# Altium project isg_cena_host_board_rev1.PrjPcb (part 2 of 2)

## Sheet DACs.SchDoc
size A; SheetNumber: 7; SheetTotal: 9
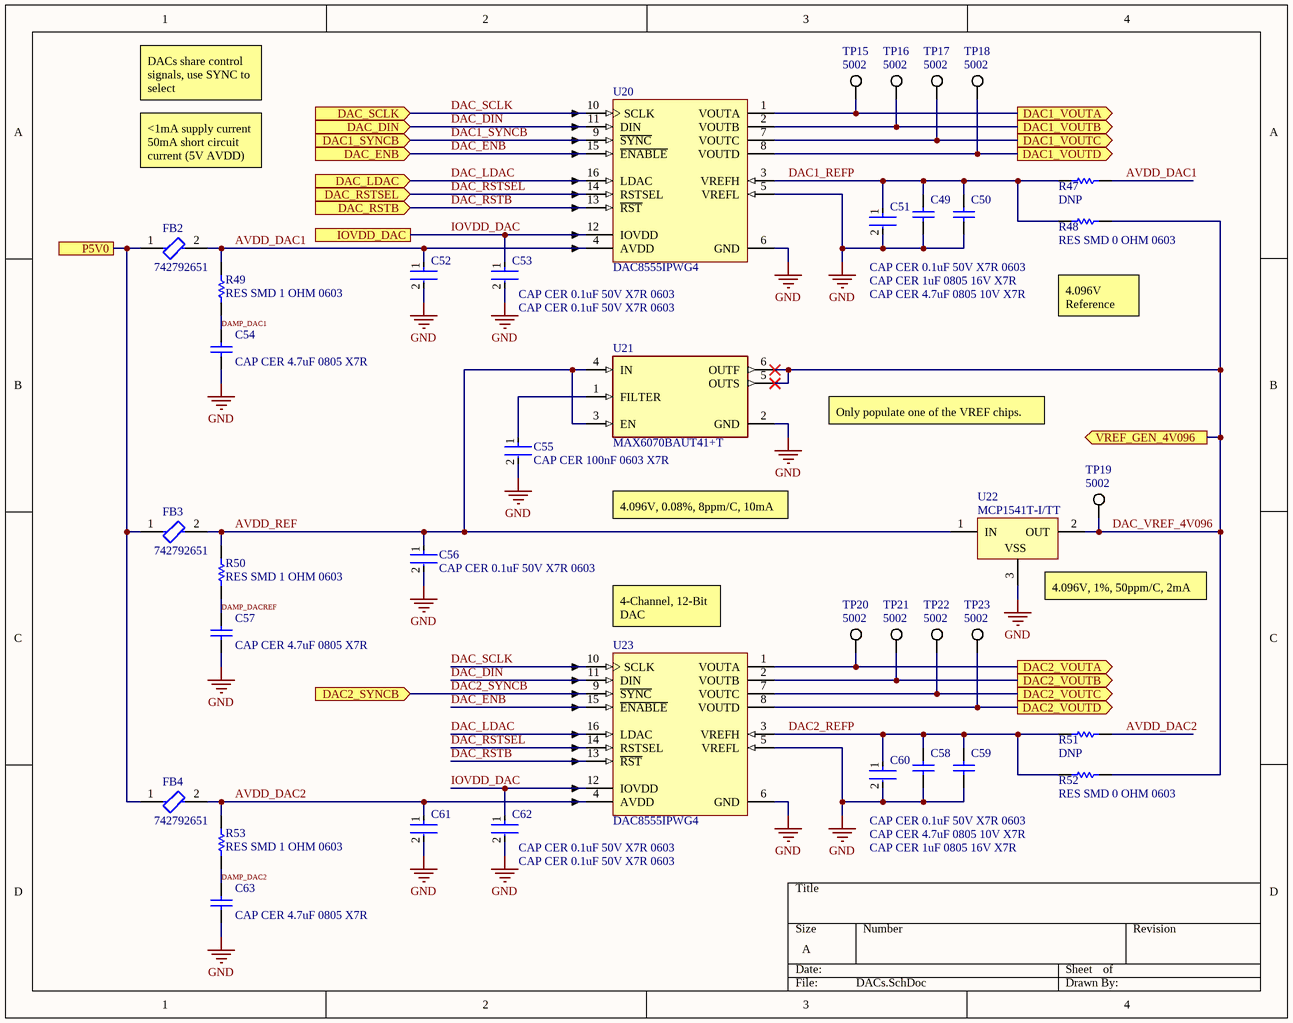
[diagram p5: DACs.SchDoc]

### Parts
(Parts that share a designator on the sheet are numbered #1, #2 ... from top to bottom, then left to right.)
C49  CAP CER 1uF 0805 16V X7R  [CAPC2013X140X50NL20T25]
C50  CAP CER 4.7uF 0805 10V X7R  [CAPC2013X140X50NL20T25]
C51  CAP CER 0.1uF 50V X7R 0603  [FP-CC0603-DA-MFG]
C52  CAP CER 0.1uF 50V X7R 0603  [FP-CC0603-DA-MFG]
C53  CAP CER 0.1uF 50V X7R 0603  [FP-CC0603-DA-MFG]
C54  CAP CER 4.7uF 0805 X7R  [CAPC2013X140X50NL20T25]
C55  CAP CER 100nF 0603 X7R  [FP-CC0603-DA-MFG]
C56  CAP CER 0.1uF 50V X7R 0603  [FP-CC0603-DA-MFG]
C57  CAP CER 4.7uF 0805 X7R  [CAPC2013X140X50NL20T25]
C58#1  CAP CER 1uF 0805 16V X7R  [CAPC2013X140X50NL20T25]
C59#1  CAP CER 4.7uF 0805 10V X7R  [CAPC2013X140X50NL20T25]
C60#1  CAP CER 0.1uF 50V X7R 0603  [FP-CC0603-DA-MFG]
C61#1  CAP CER 0.1uF 50V X7R 0603  [FP-CC0603-DA-MFG]
C62#1  CAP CER 0.1uF 50V X7R 0603  [FP-CC0603-DA-MFG]
C63#1  CAP CER 4.7uF 0805 X7R  [CAPC2013X140X50NL20T25]
FB2  742792651  [FP-742792651-MFG]
FB3  742792651  [FP-742792651-MFG]
FB4  742792651  [FP-742792651-MFG]
R47  DNP  [RESC1609X50X30LL10T20]
R48  RES SMD 0 OHM 0603  [RESC1609X50X30LL10T20]
R49  RES SMD 1 OHM 0603  [RESC1609X50X30LL10T20]
R50#1  RES SMD 1 OHM 0603  [RESC1609X50X30LL10T20]
R51#1  DNP  [RESC1609X50X30LL10T20]
R52#1  RES SMD 0 OHM 0603  [RESC1609X50X30LL10T20]
R53#1  RES SMD 1 OHM 0603  [RESC1609X50X30LL10T20]
TP15  5002  [KSTN-5002]
TP16  5002  [KSTN-5002]
TP17  5002  [KSTN-5002]
TP18  5002  [KSTN-5002]
TP19  5002  [KSTN-5002]
TP20  5002  [KSTN-5002]
TP21  5002  [KSTN-5002]
TP22  5002  [KSTN-5002]
TP23#2  5002  [KSTN-5002]
U20  DAC8555IPWG4  [TI-PW16_L]
U21  MAX6070BAUT41+T  [FP-U6-5-MFG]
U22  MCP1541T-I/TT  [SOT-23-TT3_L]
U23  DAC8555IPWG4  [TI-PW16_L]

### Ports
DAC1_SYNCB (in), DAC1_VOUTA (out), DAC1_VOUTB (out), DAC1_VOUTC (out), DAC1_VOUTD (out), DAC2_SYNCB (in), DAC2_VOUTA (out), DAC2_VOUTB (out), DAC2_VOUTC (out), DAC2_VOUTD (out), DAC_DIN (in), DAC_ENB (in), DAC_LDAC (in), DAC_RSTB (in), DAC_RSTSEL (in), DAC_SCLK (in), IOVDD_DAC, P5V0, VREF_GEN_4V096 (out)

### Nets
GND: C49.2 C50.2 C51.2 C52.2 C53.2 C54.2 C55.2 C56.2 C57.2 C58#1.2 C59#1.2 C60#1.2 C61#1.2 C62#1.2 C63#1.2 U20.5(VREFL) U20.6(GND) U21.2(GND) U22.3(VSS) U23.5(VREFL) U23.6(GND)
IOVDD_DAC: C53.1 C62#1.1 U20.12(IOVDD) U23.12(IOVDD) ; port IOVDD_DAC  [project net IOVDD]
P5V0: FB2.1 FB3.1 FB4.1 ; port P5V0
AVDD_DAC1: C52.1 FB2.2 R47.2 R49.2 U20.4(AVDD)
AVDD_DAC2: C61#1.1 FB4.2 R51#1.2 R53#1.2 U23.4(AVDD)
AVDD_REF: C56.1 FB3.2 R50#1.2 U21.3(EN) U21.4(IN) U22.1(IN)
DAC1_REFP: C49.1 C50.1 C51.1 R47.1 R48.1 U20.3(VREFH)
DAC1_SYNCB: U20.9(~{SYNC}) ; port DAC1_SYNCB
DAC1_VOUTA: TP15.1 U20.1(VOUTA) ; port DAC1_VOUTA
DAC1_VOUTB: TP16.1 U20.2(VOUTB) ; port DAC1_VOUTB
DAC1_VOUTC: TP17.1 U20.7(VOUTC) ; port DAC1_VOUTC
DAC1_VOUTD: TP18.1 U20.8(VOUTD) ; port DAC1_VOUTD
DAC2_REFP: C58#1.1 C59#1.1 C60#1.1 R51#1.1 R52#1.1 U23.3(VREFH)
DAC2_SYNCB: U23.9(~{SYNC}) ; port DAC2_SYNCB
DAC2_VOUTA: TP20.1 U23.1(VOUTA) ; port DAC2_VOUTA
DAC2_VOUTB: TP21.1 U23.2(VOUTB) ; port DAC2_VOUTB
DAC2_VOUTC: TP22.1 U23.7(VOUTC) ; port DAC2_VOUTC
DAC2_VOUTD: TP23#2.1 U23.8(VOUTD) ; port DAC2_VOUTD
DAC_DIN: U20.11(DIN) U23.11(DIN) ; port DAC_DIN
DAC_ENB: U20.15(~{ENABLE}) U23.15(~{ENABLE}) ; port DAC_ENB
DAC_LDAC: U20.16(LDAC) U23.16(LDAC) ; port DAC_LDAC
DAC_RSTB: U20.13(~{RST}) U23.13(~{RST}) ; port DAC_RSTB
DAC_RSTSEL: U20.14(RSTSEL) U23.14(RSTSEL) ; port DAC_RSTSEL
DAC_SCLK: U20.10(SCLK) U23.10(SCLK) ; port DAC_SCLK
DAC_VREF_4V096: R48.2 R52#1.2 TP19.1 U21.5(OUTS) U21.6(OUTF) U22.2(OUT) ; port VREF_GEN_4V096
DAMP_DAC1: C54.1 R49.1
DAMP_DAC2: C63#1.1 R53#1.1
DAMP_DACREF: C57.1 R50#1.1
NetC55_1: C55.1 U21.1(FILTER)

### Notes on the sheet
- DACs share control signals, use SYNC to select
- <1mA supply current
  50mA short circuit current (5V AVDD)
- 4.096V Reference
- Only populate one of the VREF chips.
- 4.096V, 0.08%, 8ppm/C, 10mA
- (near U23) 4-Channel, 12-Bit DAC
- (near U22) 4.096V, 1%, 50ppm/C, 2mA

### Library data of the parts
C49 C50 C54 C57 C58#1 C59#1 C63#1 = CMP-2007-04677-1: Part Number: 0805ZC475KAT2A; Manufacturer: AVX Interconnect / Elco
C51-C53 C56 C60#1 C61#1 C62#1 = CMP-03422-000030-1: Manufacturer Part Number: CC0603KRX7R7BB104; Manufacturer: YAGEO; Voltage Rating: 16 V; Tolerance: 0.1; Value: 100 nF; Temperature Coefficient: 15%; Material: Ceramic; Package: CC0603-DA; ComponentLink2Description: Datasheet; Octopart: https://octopart.com/cc0603krx7r7bb104-yageo-192941; Temperature Range High: +125°C; Digikey Description: CAP CER 0.1UF 16V X7R 0603; Voltage: 16 V; Device Class L2: Capacitors; Height: 0.9mm; Temperature: -55°C to +125°C; Device Class L1: Passive Components; Device Class L3: Ceramic Capacitors; ComponentLink2URL: http://www.yageo.com/documents/recent/UPY-GPHC_X7R_6.3V-to-50V_18.pdf; Footprint Url: http://www.yageo.com/exep/pages/download/literatures/UPY-C_GEN_24.pdf; RoHS: TRUE; Temperature Range Low: -55°C; Temperature Characteristic: X7R; Lead Free: Yes; Capacitance: 100 nF; Category: Cap; Mouser Description: Multilayer Ceramic Capacitor, CC Series, 0.1 - F, - 10%, X7R, 16 V, 0603 [1608 Metric]; Automotive: No
C55 = CMP-03422-000030-1: CAP CER 0.1UF 16V X7R 0603; Manufacturer Part Number: CC0603KRX7R7BB104; Manufacturer: YAGEO; Tolerance: 0.1; Temperature Coefficient: 15%; Material: Ceramic; Voltage Rating: 16 V; Package: CC0603-DA; ComponentLink2Description: Datasheet; Octopart: https://octopart.com/cc0603krx7r7bb104-yageo-192941; Temperature Range High: +125°C; Digikey Description: CAP CER 0.1UF 16V X7R 0603; Value: 100 nF; Voltage: 16 V; Device Class L2: Capacitors; Height: 0.9mm; Temperature: -55°C to +125°C; Device Class L1: Passive Components; Device Class L3: Ceramic Capacitors; ComponentLink2URL: http://www.yageo.com/documents/recent/UPY-GPHC_X7R_6.3V-to-50V_18.pdf; Footprint Url: http://www.yageo.com/exep/pages/download/literatures/UPY-C_GEN_24.pdf; RoHS: TRUE; Temperature Range Low: -55°C; Temperature Characteristic: X7R; Lead Free: Yes; Capacitance: 100 nF; Category: Cap; Mouser Description: Multilayer Ceramic Capacitor, CC Series, 0.1 - F, - 10%, X7R, 16 V, 0603 [1608 Metric]; Automotive: No
FB2-FB4 = CMP-0220-00181-2: FERRITE BEAD 600 OHM 0603 1LN; Tolerance: 25%; DC Resistance (DCR): 200mR; Inductance: 0.36H; Current Rating: 1A; Test Frequency: 100MHz; Impedance: 600R; Number of Lines: 1; Length: 1.6mm; Termination: SMD/SMT; Case Code (Metric): 1608; Case/Package: SMD/SMT; Min Operating Temperature: -55°C; Resistance: 200mR; Height: 0.8mm; Width: 0.8mm; Max Operating Temperature: 125°C; Package Quantity: 1; Mount: Surface Mount; Max DC Current: 1A; Max Current Rating: 1A; Weight: 0.000141oz; Packaging: Tape and Reel; Lead Free: Lead Free; Case Code (Imperial): 0603; Series: WE-CBF; Core Material: Ferrite; Material: Ferrite; RoHS Compliant: Yes; Depth: 0.8mm
R47-R49 R50#1 R51#1 R52#1 R53#1 = CMP-2000-03820-1: Part Number: CRCW0603100KFKEA; Manufacturer: Vishay Dale
TP15-TP22 TP23#2 = CMP-2000-05182-1: Test Point, White, 1-Pin THD, RoHS, Bulk; Manufacturer: KeystoneElectronics; Outside Diameter: 2.54mm; Plating: Silver; Mounting Hole Size: 1mm; Product: TestPoints; Packaging: Bulk; Manufacturer URL: http://www.keyelco.com/; Length: 7.62mm; Datasheet Version: Rev. G, 12/2008; Type: Miniature; Product Category: CircuitBoardHardware-PCB; Material: Nylon; RoHS: True; Contact Material: PhosphorBronze; Datasheet URL: https://ciiva.com/datasheet-click-2917627?src=ciiva&sig=bd195616; Color: White; Brand: KeystoneElectronics
U20 U23 = CMP-0004-01174-1: 16-Bit, Quad Channel, Ultralow Glitch, Voltage Output Digital to Analog Converter, -40 to 105 degC, 16-pin SOP (PW16), Green (RoHS & no Sb/Br); Manufacturer: Texas Instruments; SubFamily: Precision DAC (=<10MSPS); Resolution(Bits): 16; SNR(dB): 95; Interface: Serial SPI; SFDR(dB): 87; DAC Channels: 4; Settling Time(us): 10; DNL(Max)(+/-LSB): 1; ComponentLink2Description: Datasheet; PackageReference: PW16; PackageVersion: 4040064-4/G, 02/2011; ComponentLink3Description: Package Specification; Code_JEDEC: MO-153; Eco-Plan: Green (RoHS & no Sb/Br); Mounting Technology: Surface Mount; DatasheetVersion: SLAS475B; PackageDescription: 16-Pin Plastic Small Outline, Body 5 x 4.4 mm, Pitch 0.65 mm; ComponentLink1Description: Manufacturer URL; ComponentLink1URL: http://www.ti.com/; ComponentLink3URL: http://www.ti.com/lit/ml/mpds361/mpds361.pdf; PartNumber: DAC8555IPWG4; ComponentLink2URL: http://www.ti.com/general/docs/lit/getliterature.tsp?genericPartNumber=DAC8555&fileType=pdf
U21 = CMP-05720-000007-1: IC VREF SERIES 0.04% SOT23-6; Output Current: 10mA; Max Input Voltage: 5.5V; Operating Supply Current: 300uA; Output Voltage: 3V; Number of Channels: 1; Quiescent Current: 235uA; Output Type: Fixed; Temperature Coefficient: 6ppm/°C; Min Input Voltage: 2.7V; Number of Pins: 6; Max Operating Temperature: 125°C; Packaging: Tape and Reel; Min Output Voltage: 3V; Case/Package: SOT-23-6; Tolerance: 0.04%; Reference Voltage: 3V; Min Operating Temperature: -40°C; Mount: Surface Mount; Package Quantity: 2500; Reference Type: Series
U22 = CMP-0131-00004-1: 4.096V Voltage Reference, 3-Pin SOT-23, Industrial Temperature, Tape and Reel; Code_IPC: SOT23-3; DatasheetVersion: revB, Feb-2005; PackageReference: SOT-23-TT3; PackageDescription: 3-Lead Plastic Small Outline Transistor (TT) [SOT-23]; PackageVersion: revBB, Aug-2009

## Sheet TIA_signal_path_ADC.SchDoc
size B; SheetNumber: 2; SheetTotal: 9
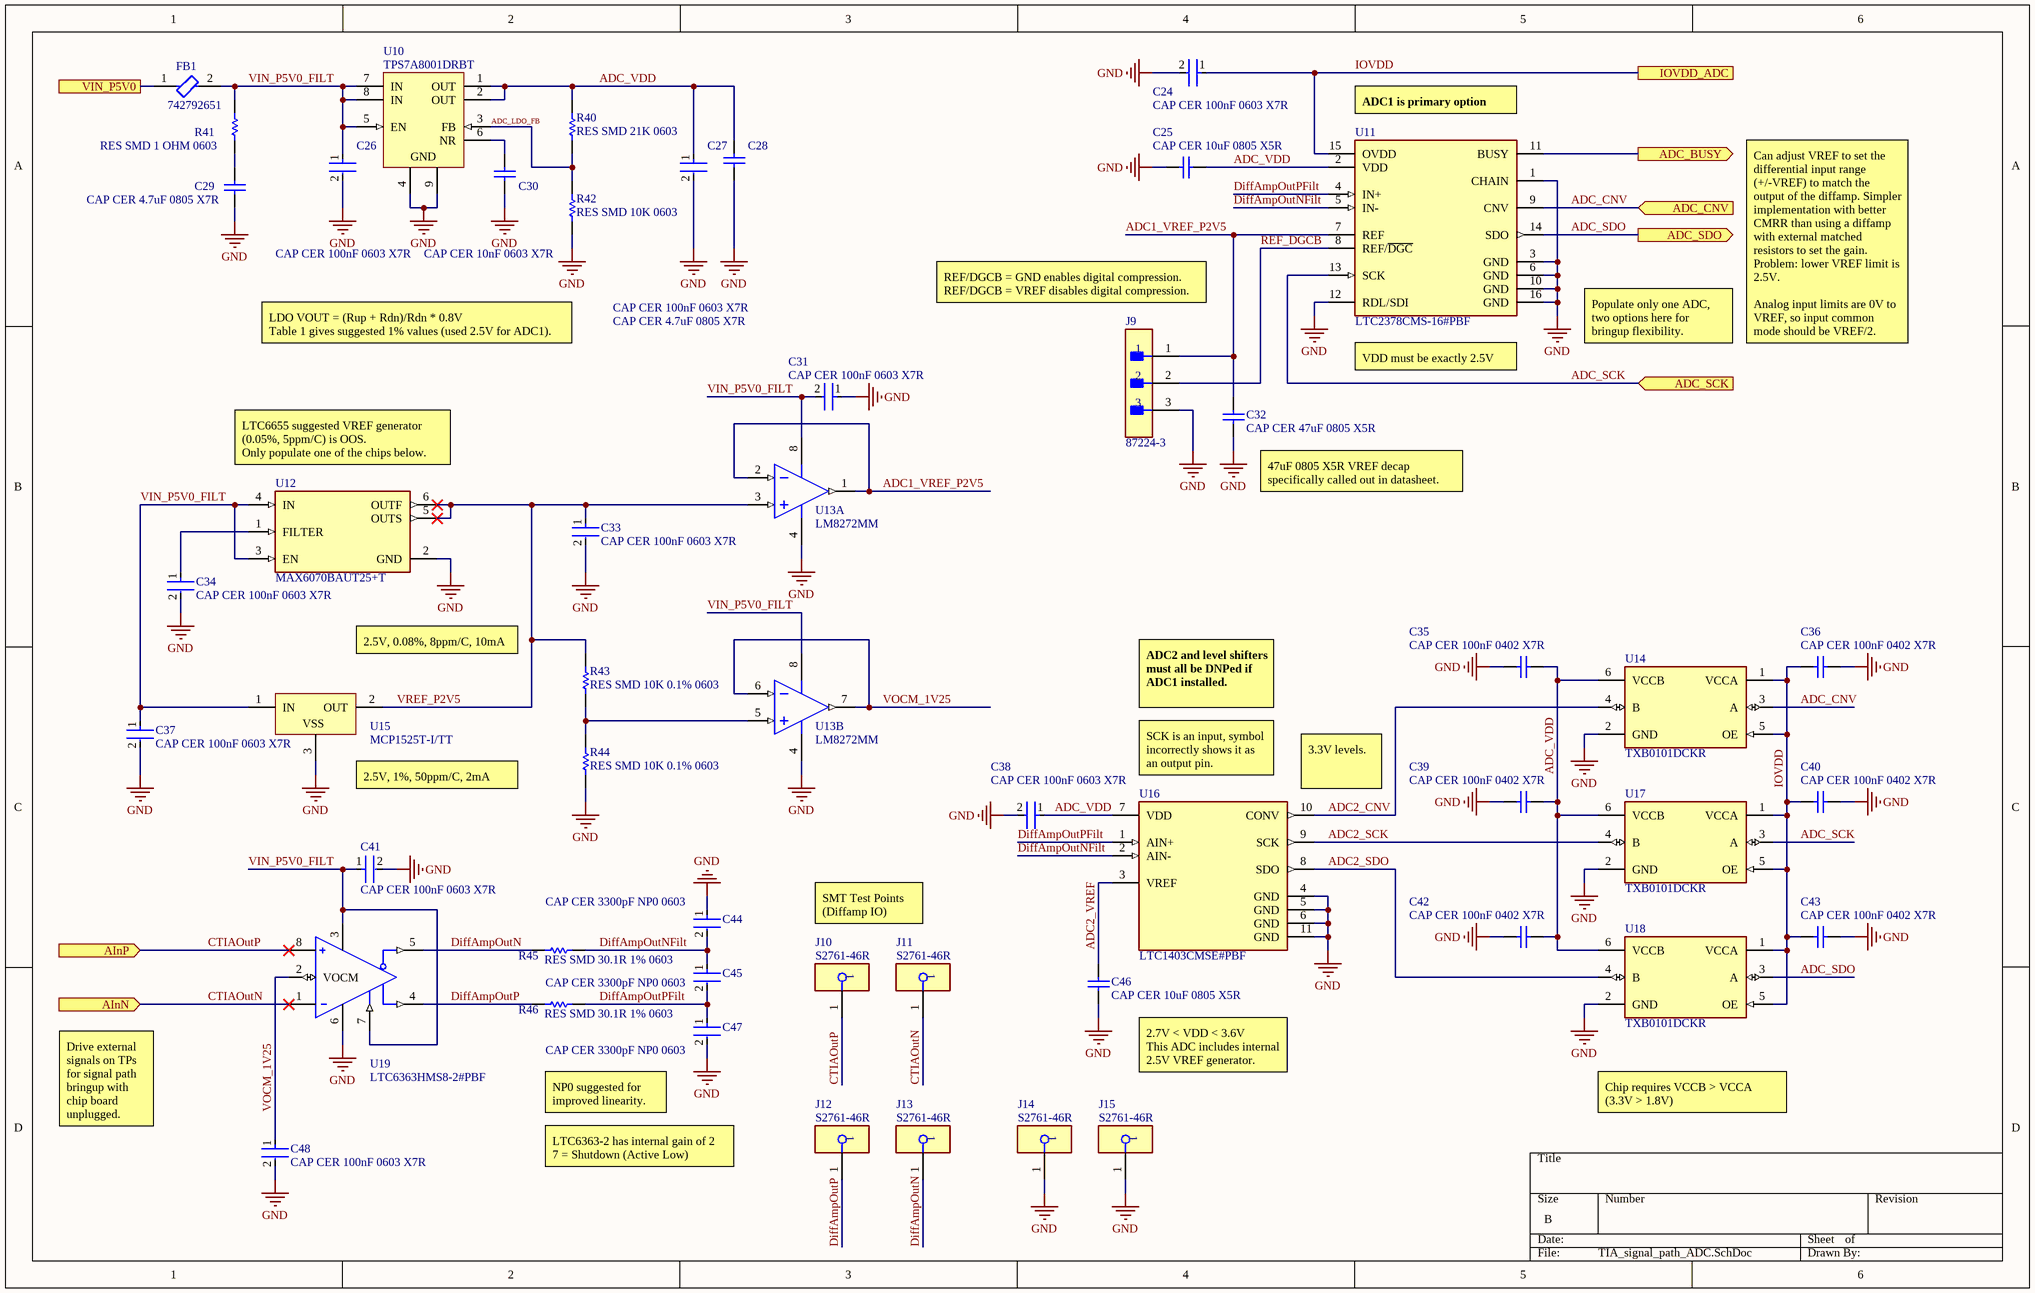
[diagram p6: TIA_signal_path_ADC.SchDoc]

### Parts
(Parts that share a designator on the sheet are numbered #1, #2 ... from top to bottom, then left to right.)
C24  CAP CER 100nF 0603 X7R  [FP-CC0603-DA-MFG]
C25  CAP CER 10uF 0805 X5R  [CAPC2013X140X50NL20T25]
C26#2  CAP CER 100nF 0603 X7R  [FP-CC0603-DA-MFG]
C27#2  CAP CER 100nF 0603 X7R  [FP-CC0603-DA-MFG]
C28#2  CAP CER 4.7uF 0805 X7R  [CAPC2013X140X50NL20T25]
C29#2  CAP CER 4.7uF 0805 X7R  [CAPC2013X140X50NL20T25]
C30#2  CAP CER 10nF 0603 X7R  [CAPC1608X90X40ML10T20]
C31#2  CAP CER 100nF 0603 X7R  [FP-CC0603-DA-MFG]
C32#2  CAP CER 47uF 0805 X5R  [CAPC2013X140X50NL20T25]
C33#2  CAP CER 100nF 0603 X7R  [FP-CC0603-DA-MFG]
C34#2  CAP CER 100nF 0603 X7R  [FP-CC0603-DA-MFG]
C35  CAP CER 100nF 0402 X7R  [CAPC1050X55X23ML05T13]
C36#2  CAP CER 100nF 0402 X7R  [CAPC1050X55X23ML05T13]
C37#2  CAP CER 100nF 0603 X7R  [FP-CC0603-DA-MFG]
C38  CAP CER 100nF 0603 X7R  [FP-CC0603-DA-MFG]
C39  CAP CER 100nF 0402 X7R  [CAPC1050X55X23ML05T13]
C40  CAP CER 100nF 0402 X7R  [CAPC1050X55X23ML05T13]
C41  CAP CER 100nF 0603 X7R  [FP-CC0603-DA-MFG]
C42  CAP CER 100nF 0402 X7R  [CAPC1050X55X23ML05T13]
C43  CAP CER 100nF 0402 X7R  [CAPC1050X55X23ML05T13]
C44  CAP CER 3300pF NP0 0603  [FP-CC0603-DA-MFG]
C45  CAP CER 3300pF NP0 0603  [FP-CC0603-DA-MFG]
C46  CAP CER 10uF 0805 X5R  [CAPC2013X140X50NL20T25]
C47  CAP CER 3300pF NP0 0603  [FP-CC0603-DA-MFG]
C48  CAP CER 100nF 0603 X7R  [FP-CC0603-DA-MFG]
FB1  742792651  [FP-742792651-MFG]
J9#1  87224-3  [FP-87224-3-MFG]
J10  S2761-46R  [FP-S2761-46R-MFG]
J11  S2761-46R  [FP-S2761-46R-MFG]
J12#1  S2761-46R  [FP-S2761-46R-MFG]
J13#1  S2761-46R  [FP-S2761-46R-MFG]
J14#1  S2761-46R  [FP-S2761-46R-MFG]
J15#1  S2761-46R  [FP-S2761-46R-MFG]
R40#2  RES SMD 21K 0603  [RESC1609X50X30LL10T20]
R41#2  RES SMD 1 OHM 0603  [RESC1609X50X30LL10T20]
R42  RES SMD 10K 0603  [RESC1609X50X30LL10T20]
R43  RES SMD 10K 0.1% 0603  [RESC1609X50X30LL10T20]
R44  RES SMD 10K 0.1% 0603  [RESC1609X50X30LL10T20]
R45  RES SMD 30.1R 1% 0603  [RESC1609X50X30LL10T20]
R46  RES SMD 30.1R 1% 0603  [RESC1609X50X30LL10T20]
U10  TPS7A8001DRBT  [DRB0008A_V]
U11#2  LTC2378CMS-16#PBF  [FP-MS-16-05-08-1669-IPC_B]
U12  MAX6070BAUT25+T  [FP-U6-5-MFG]
U13  LM8272MM  [DGK0008A_L]  (parts A,B of 2)
U14  TXB0101DCKR  [FP-DCK0006A-MFG]
U15  MCP1525T-I/TT  [SOT-23-TT3_M]
U16  LTC1403CMSE#PBF  [FP-MSE-10-05-08-1664-IPC_B]
U17  TXB0101DCKR  [FP-DCK0006A-MFG]
U18  TXB0101DCKR  [FP-DCK0006A-MFG]
U19  LTC6363HMS8-2#PBF  [FP-MS8-8-05-08-1660-IPC_A]

### Ports
ADC_BUSY (out), ADC_CNV (in), ADC_SCK (in), ADC_SDO (out), AInN (in), AInP (in), IOVDD_ADC, VIN_P5V0

### Nets
GND: C24.2 C25.1 C26#2.2 C27#2.2 C28#2.2 C29#2.2 C30#2.2 C31#2.1 C32#2.2 C33#2.2 C34#2.2 C35.2 C36#2.2 C37#2.2 C38.2 C39.2 C40.2 C41.2 C42.2 C43.2 C44.1 C46.1 C47.2 C48.2 J9#1.3 J14#1.1 J15#1.1 R42.1 R44.1 U10.4(GND) U10.9(GND) U11#2.1(CHAIN) U11#2.3(GND) U11#2.6(GND) U11#2.10(GND) U11#2.12(RDL/SDI) U11#2.16(GND) U12.2(GND) U13.4(V-) U14.2(GND) U15.3(VSS) U16.4(GND) U16.5(GND) U16.6(GND) U16.11(GND) U17.2(GND) U18.2(GND) U19.6(V-)
IOVDD: C24.1 C36#2.1 C40.1 C43.1 U11#2.15(OVDD) U14.1(VCCA) U14.5(OE) U17.1(VCCA) U17.5(OE) U18.1(VCCA) U18.5(OE) ; port IOVDD_ADC
P5V0: FB1.1 ; port VIN_P5V0
ADC1_VREF_P2V5: C32#2.1 J9#1.1 U11#2.7(REF) U13.1(OUTA) U13.2(INA-)
ADC2_CNV: U14.4(B) U16.10(CONV)
ADC2_SCK: U16.9(SCK) U17.4(B)
ADC2_SDO: U16.8(SDO) U18.4(B)
ADC2_VREF: C46.2 U16.3(VREF)
ADC_CNV: U11#2.9(CNV) U14.3(A) ; port ADC_CNV
ADC_LDO_FB: R40#2.1 R42.2 U10.3(FB)
ADC_SCK: U11#2.13(SCK) U17.3(A) ; port ADC_SCK
ADC_SDO: U11#2.14(SDO) U18.3(A) ; port ADC_SDO
ADC_VDD: C25.2 C27#2.1 C28#2.1 C35.1 C38.1 C39.1 C42.1 R40#2.2 U10.1(OUT) U10.2(OUT) U11#2.2(VDD) U14.6(VCCB) U16.7(VDD) U17.6(VCCB) U18.6(VCCB)
CTIAOutN: J11.1 U19.1(-IN) ; port AInN
CTIAOutP: J10.1 U19.8(+IN) ; port AInP
DiffAmpOutN: J13#1.1 R45.2 U19.5(-OUT)
DiffAmpOutNFilt: C44.2 C45.1 R45.1 U11#2.5(IN-) U16.2(AIN-)
DiffAmpOutP: J12#1.1 R46.2 U19.4(+OUT)
DiffAmpOutPFilt: C45.2 C47.1 R46.1 U11#2.4(IN+) U16.1(AIN+)
REF_DGCB: J9#1.2 U11#2.8(REF/~{DGC})
SP_ADC_BUSY: U11#2.11(BUSY) ; port ADC_BUSY
VIN_P5V0_FILT: C26#2.1 C31#2.2 C37#2.1 C41.1 FB1.2 R41#2.2 U10.5(EN) U10.7(IN) U10.8(IN) U12.3(EN) U12.4(IN) U13.8(V+) U15.1(IN) U19.3(V+) U19.7(~{SHDN})
VOCM_1V25: C48.1 U13.6(INB-) U13.7(OUTB) U19.2(VOCM)
VREF_P2V5: C33#2.1 R43.2 U12.5(OUTS) U12.6(OUTF) U13.3(INA+) U15.2(OUT)
NetC29#2_1: C29#2.1 R41#2.1
NetC30#2_1: C30#2.1 U10.6(NR)
NetC34#2_1: C34#2.1 U12.1(FILTER)
NetR43_1: R43.1 R44.2 U13.5(INB+)

### Notes on the sheet
- (near U11#2) ADC1 is primary option
- REF/DGCB = GND enables digital compression.
  REF/DGCB = VREF disables digital compression.
- LDO VOUT = (Rup + Rdn)/Rdn * 0.8V
  Table 1 gives suggested 1% values (used 2.5V for ADC1).
- (near U11#2) VDD must be exactly 2.5V
- Populate only one ADC, two options here for bringup flexibility.
- Can adjust VREF to set the differential input range (+/-VREF) to match the output of the diffamp. Simpler implementation with better CMRR than using a diffamp with external matched resistors to set the gain. Problem: lower VREF limit is 2.5V.
  Analog input limits are 0V to VREF, so input common mode should be VREF/2.
- (near U12) LTC6655 suggested VREF generator (0.05%, 5ppm/C) is OOS.
  Only populate one of the chips below.
- (near C32#2) 47uF 0805 X5R VREF decap specifically called out in datasheet.
- 2.5V, 0.08%, 8ppm/C, 10mA
- ADC2 and level shifters must all be DNPed if ADC1 installed.
- (near U16) SCK is an input, symbol incorrectly shows it as an output pin.
- (near U15) 2.5V, 1%, 50ppm/C, 2mA
- (near U16) 3.3V levels.
- SMT Test Points
  (Diffamp IO)
- NP0 suggested for improved linearity.
- (near C46) 2.7V < VDD < 3.6V
  This ADC includes internal 2.5V VREF generator.
- Chip requires VCCB > VCCA
  (3.3V > 1.8V)
- Drive external signals on TPs for signal path bringup with chip board unplugged.
- LTC6363-2 has internal gain of 2
  7 = Shutdown (Active Low)

### Library data of the parts
C24 C26#2 C27#2 C31#2 C33#2 C34#2 C37#2 C38 C41 C48 = CMP-03422-000030-1: as C55 on sheet DACs; Voltage Rating: 16 V; Package: CC0603-DA; ComponentLink2Description: Datasheet; Octopart: https://octopart.com/cc0603krx7r7bb104-yageo-192941; Temperature Range High: +125°C; Digikey Description: CAP CER 0.1UF 16V X7R 0603; Value: 100 nF; Voltage: 16 V; Device Class L2: Capacitors; Height: 0.9mm; Temperature: -55°C to +125°C; Device Class L1: Passive Components; Device Class L3: Ceramic Capacitors; ComponentLink2URL: http://www.yageo.com/documents/recent/UPY-GPHC_X7R_6.3V-to-50V_18.pdf; Footprint Url: http://www.yageo.com/exep/pages/download/literatures/UPY-C_GEN_24.pdf; RoHS: TRUE; Temperature Range Low: -55°C; Temperature Characteristic: X7R; Lead Free: Yes; Capacitance: 100 nF; Category: Cap; Mouser Description: Multilayer Ceramic Capacitor, CC Series, 0.1 - F, - 10%, X7R, 16 V, 0603 [1608 Metric]; Automotive: No
C25 C28#2 C29#2 C32#2 C46 = CMP-2007-04677-1: as C49 on sheet DACs
C30#2 = CMP-2100-03600-1: Chip Capacitor, 10 nF, +/- 10%, 50 V, -55 to 125 degC, 0603 (1608 Metric), RoHS, Tape and Reel; Manufacturer: Yageo; Insulation Resistance: 100GR; Voltage Rating (DC): 50V; Material: Ceramic; Lead Free: LeadFree; Case/Package: 0603; Datasheet Version: Rev. 15, 10/2016; Composition: Ceramic; Radiation Hardening: No; Thickness: 0.035inch; RoHSCompliant: True; Dielectric: X7R; Termination: SMD/SMT; Capacitance: 10nF; Manufacturer URL: http://www.yageo.com/; Tolerance: 10%; REACH SVHC: NoSVHC; Voltage: 50V; Max Operating Temperature: 125degC; Case Code (Metric): 1608; Package Quantity: 1; Case Code (Imperial): 0603; Packaging: TapeandReel; Package Reference: 0603; Width: 0.031inch; Datasheet URL: http://www.yageo.com/documents/recent/UPY-GPHC_X7R_6.3V-to-50V_15.pdf; Length: 1.6mm; Min Operating Temperature: -55degC; Number of Pins: 2; Depth: 0.8mm; Mount: SurfaceMount; Height: 0.8mm; Voltage Rating: 50V; Package Description: 2-Pin Surface Mount Device, Body 1.6 x 0.8 mm
C35 C36#2 C39 C40 C42 C43 = CMP-2000-05439-1: Chip Capacitor, 100 nF, +/- 10%, 16 V, -55 to 125 degC, 0402 (1005 Metric), RoHS, Tape and Reel; Manufacturer: Samsung Electro-Mechanics; Capacitance: 100000pF; Rated Voltage: 16V; Case Size/Dimension: 0402; Tolerance (%): ±10%; Manufacturer URL: http://www.samsungsem.com/global/index.jsp; Dielectric: X7R; Datasheet URL: https://datasheet.ciiva.com/29198/458718-da-01-en-vs-kondensator-0402-29198423.pdf; Datasheet Version: Nov-10
C44 C45 C47 = CMP-03422-000030-1: CAP CER 3300pF X7R 0603; Manufacturer Part Number: CC0603KRX7R7BB104; Manufacturer: YAGEO; Voltage Rating: 16 V; Tolerance: 0.1; Value: 100 nF; Temperature Coefficient: 15%; Material: Ceramic; Package: CC0603-DA; ComponentLink2Description: Datasheet; Octopart: https://octopart.com/cc0603krx7r7bb104-yageo-192941; Temperature Range High: +125°C; Digikey Description: CAP CER 0.1UF 16V X7R 0603; Voltage: 16 V; Device Class L2: Capacitors; Height: 0.9mm; Temperature: -55°C to +125°C; Device Class L1: Passive Components; Device Class L3: Ceramic Capacitors; ComponentLink2URL: http://www.yageo.com/documents/recent/UPY-GPHC_X7R_6.3V-to-50V_18.pdf; Footprint Url: http://www.yageo.com/exep/pages/download/literatures/UPY-C_GEN_24.pdf; RoHS: TRUE; Temperature Range Low: -55°C; Temperature Characteristic: X7R; Lead Free: Yes; Capacitance: 100 nF; Category: Cap; Mouser Description: Multilayer Ceramic Capacitor, CC Series, 0.1 - F, - 10%, X7R, 16 V, 0603 [1608 Metric]; Automotive: No
FB1 = CMP-0220-00181-2: as FB2 on sheet DACs; Length: 1.6mm; Termination: SMD/SMT; Case Code (Metric): 1608; Case/Package: SMD/SMT; Min Operating Temperature: -55°C; Resistance: 200mR; Height: 0.8mm; Width: 0.8mm; Max Operating Temperature: 125°C; Package Quantity: 1; Mount: Surface Mount; Max DC Current: 1A; Max Current Rating: 1A; Weight: 0.000141oz; Packaging: Tape and Reel; Lead Free: Lead Free; Case Code (Imperial): 0603; Series: WE-CBF; Core Material: Ferrite; Material: Ferrite; RoHS Compliant: Yes; Depth: 0.8mm
J9#1 = CMP-2000-05697-2: CONN HEADER VERT 3POS 2.54MM; Number of Positions: 3; Gasket: No (Without); High Speed Serial Data Connector: No; Current Rating: 3A; Contact Post Length: 0.125inch; PCB Thickness: 1.397mm; PCB Mount Retention: Without; Connector Type: Plug; Approvals: CSA; PCB Mounting Orientation: Vertical; Pitch: 2.54mm; Mating Alignment: No (Without); Housing Color: Black; Contact Gender: Male; Length: 7.21mm; Max Operating Temperature: 105°C; Strain Relief: No (Without); Contact Material: Bronze; Row Spacing: 2.54mm; Series: AMPMODU MOD II; Board Standoff: No (Without); Package Quantity: 520; Radiation Hardening: No; Contact Protection: No (Without); Stabilizers: No (Without); Number of Rows: 1; Contact Mating Length: 8.08mm; Contact Shape: Square; Depth: 2.54mm; Contact Current Rating: 3A; Flammability Rating: UL94 V-0; Packaging: Carton; Number of Contacts: 3; Orientation: Straight; Mount: Through Hole; Keyed: No; Contact Type: Male Pin; Housing Material: Thermoplastic; High Temperature Housing: No; ELV: Compliant; Contact Plating: Gold; Termination: Through Hole; Selectively Loaded: No (Without); Lead Free: Lead Free; Min Operating Temperature: -65°C; Mating Connector Lock: No (Without); Color: Black; RoHS Compliant: Yes
J10 J11 J12#1 J13#1 J14#1 J15#1 = CMP-15817-000011-1: PC TEST POINT NATURAL; Body Material: Brass; Plating: Tin; Material: Copper Alloy; Mount: Surface Mount; Color: Natural; Packaging: Tape and Reel; RoHS Compliant: Yes
R40#2 R42-R46 = CMP-2000-03820-1: DNP; Part Number: CRCW0603100KFKEA; Manufacturer: Vishay Dale
R41#2 = CMP-2000-03820-1: as R47 on sheet DACs
U10 = CMP-0395-00597-2: Single Output LDO, 1 A, Adjustable 0.8 to 6 V Output, 2.2 to 6.5 V Input, with High-Bandwidth PSRR, 8-pin SON (DRB), -40 to 125 degC, Green (RoHS & no Sb/Br); Manufacturer: Texas Instruments; Vin(Min)(V): 2.2; Iq(Typ)(mA): 0.04; Vout Adj(Max)(V): 6; SubFamily: Single Channel LDO; Accuracy(%): 3; Vin(Max)(V): 6.5; Vdo(Typ)(mV): 170; Vout Adj(Min)(V): 0.8; Iout(Max)(A): 1; PackageReference: DRB0008A; ComponentLink3URL: http://www.ti.com/litv/pdf/mpds118h; Eco-Plan: Green (RoHS & no Sb/Br); ComponentLink2Description: Datasheet; PackageVersion: 4203482-2/K; PackageDescription: 8-Pin Plastic Small Outline, Body 3 x 3 mm, Pitch 0.65 mm; ComponentLink2URL: http://www.ti.com/general/docs/lit/getliterature.tsp?genericPartNumber=TPS7A8001&fileType=pdf; ComponentLink1Description: Manufacturer URL; DatasheetVersion: SBVS135G; ComponentLink1URL: http://www.ti.com/; Mounting Technology: Surface Mount; PartNumber: TPS7A8001DRBT; ComponentLink3Description: Package Specification
U11#2 = CMP-09081-000147-1: IC ADC 16BIT SAR 16MSOP; Supply Current: 5.4mA; Max Supply Voltage: 2.625V; Min Supply Voltage: 2.375V; Resolution: 16b; Interface: SPI; Number of Converters: 1; Number of Bits: 16; Operating Supply Voltage: 2.5V; Supply Type: Analog; Integral Nonlinearity (INL): 0.5LSB; Polarity: Bipolar; Max Power Dissipation: 15.8mW; Sampling Rate: 1000000S/s; Min Operating Temperature: 0°C; Package Quantity: 37; Number of Pins: 16; REACH SVHC: No SVHC; Packaging: Rail/Tube; Mount: Surface Mount; Max Operating Temperature: 70°C; Case/Package: MSOP; RoHS Compliant: Yes; Nominal Supply Current: 5.4mA; Number of Elements: 1; Lead Free: Lead Free
U12 = CMP-05720-000007-1: as U21 on sheet DACs; Number of Pins: 6; Max Operating Temperature: 125°C; Packaging: Tape and Reel; Min Output Voltage: 3V; Case/Package: SOT-23-6; Tolerance: 0.04%; Reference Voltage: 3V; Min Operating Temperature: -40°C; Mount: Surface Mount; Package Quantity: 2500; Reference Type: Series
U13 = CMP-0055-01394-3: RRIO, High Output Current & Unlimited Cap Load Op Amp, 8-pin Mini SOIC; Manufacturer: Texas Instruments; CompType: Amplifiers; PowerWise: N; PackageTopMarking: ZXTT*A60; RoHS: N; ComponentLink1Description: Datasheet URL; PinCount: 8; Code_JEDEC: MO-187-AA; Package Reference: DGK0008A; ComponentLink1URL: http://www.ti.com/general/docs/lit/getliterature.tsp?genericPartNumber=LM8272&fileType=pdf; PackageDescription: MINI SOIC, .118 x .118 x .034in, 8 Lead, .0256in Pitch
U14 U17 U18 = CMP-04899-000110-1: IC TRNSLTR BIDIRECTIONAL SC70-6; Number of Bits: 1; Low Level Output Current: 20uA; Data Rate: 100Mbps; Logic Function: Translator; Min Supply Voltage: 1.2V; Turn-On Delay Time: 7.4ns; Propagation Delay: 31ns; High Level Output Current: -20uA; Max Supply Voltage: 5.5V; Series: -; Height: 1mm; Packaging: Tape and Reel; RoHS Compliant: Yes; Width: 1.4mm; Package Quantity: 1; Mount: Surface Mount; Case/Package: SC; Length: 2.15mm; Number of Pins: 6; Max Operating Temperature: 85°C; Contact Plating: Gold; Min Operating Temperature: -40°C; Radiation Hardening: No; Lead Free: Lead Free; Number of Inputs: 1; Number of Channels: 1; REACH SVHC: No SVHC
U15 = CMP-0131-00003-1: 2.5V Voltage Reference, 3-Pin SOT-23, Industrial Temperature, Tape and Reel; DatasheetVersion: revB, Feb-2005; Code_IPC: SOT23-3; PackageDescription: 3-Lead Plastic Small Outline Transistor (TT) [SOT-23]; PackageReference: SOT-23-TT3; PackageVersion: revBB, Aug-2009
U16 = CMP-09081-000219-1: IC ADC 12BIT SAR 10MSOP; Number of Bits: 12; Min Supply Voltage: 2.7V; Interface: SPI; Max Supply Voltage: 3.6V; Integral Nonlinearity (INL): 2LSB; Sampling Rate: 2800000S/s; Resolution: 12b; Max Power Dissipation: 12mW; Operating Supply Voltage: 3V; Number of Elements: 1; Power Dissipation: 100mW; Supply Type: Single; Nominal Supply Current: 4.7mA; Polarity: Unipolar; RoHS Compliant: Yes; Max Operating Temperature: 70°C; Lead Free: Lead Free; Packaging: Rail/Tube; Number of Pins: 10; Min Operating Temperature: 0°C; Package Quantity: 50; Mount: Surface Mount; Number of Converters: 1
U19 = CMP-09116-000200-1: IC OPAMP DIFF 1 CIRCUIT 8MSOP; RoHS Compliant: Yes

## Sheet scan_chain_level_shifters.SchDoc
size B; SheetNumber: 8; SheetTotal: 9
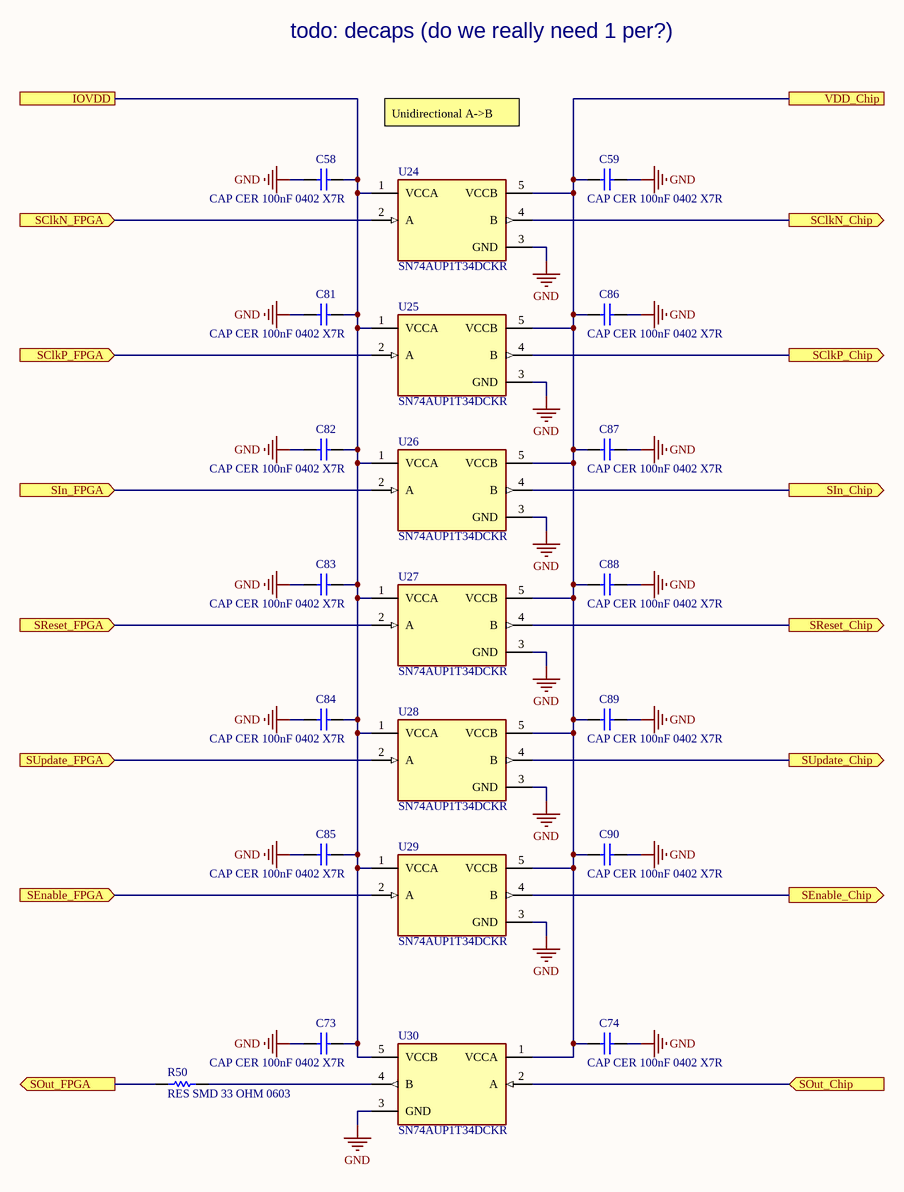
[diagram p7: scan_chain_level_shifters.SchDoc]

### Parts
(Parts that share a designator on the sheet are numbered #1, #2 ... from top to bottom, then left to right.)
C58#2  CAP CER 100nF 0402 X7R  [CAPC1050X55X23ML05T13]
C59#2  CAP CER 100nF 0402 X7R  [CAPC1050X55X23ML05T13]
C73  CAP CER 100nF 0402 X7R  [CAPC1050X55X23ML05T13]
C74  CAP CER 100nF 0402 X7R  [CAPC1050X55X23ML05T13]
C81  CAP CER 100nF 0402 X7R  [CAPC1050X55X23ML05T13]
C82  CAP CER 100nF 0402 X7R  [CAPC1050X55X23ML05T13]
C83  CAP CER 100nF 0402 X7R  [CAPC1050X55X23ML05T13]
C84  CAP CER 100nF 0402 X7R  [CAPC1050X55X23ML05T13]
C85  CAP CER 100nF 0402 X7R  [CAPC1050X55X23ML05T13]
C86  CAP CER 100nF 0402 X7R  [CAPC1050X55X23ML05T13]
C87  CAP CER 100nF 0402 X7R  [CAPC1050X55X23ML05T13]
C88  CAP CER 100nF 0402 X7R  [CAPC1050X55X23ML05T13]
C89  CAP CER 100nF 0402 X7R  [CAPC1050X55X23ML05T13]
C90  CAP CER 100nF 0402 X7R  [CAPC1050X55X23ML05T13]
R50#2  RES SMD 33 OHM 0603  [RESC1609X50X30LL10T20]
U24  SN74AUP1T34DCKR  [FP-DCK0005A-MFG]
U25  SN74AUP1T34DCKR  [FP-DCK0005A-MFG]
U26  SN74AUP1T34DCKR  [FP-DCK0005A-MFG]
U27  SN74AUP1T34DCKR  [FP-DCK0005A-MFG]
U28  SN74AUP1T34DCKR  [FP-DCK0005A-MFG]
U29  SN74AUP1T34DCKR  [FP-DCK0005A-MFG]
U30  SN74AUP1T34DCKR  [FP-DCK0005A-MFG]

### Ports
IOVDD, SClkN_Chip (out), SClkN_FPGA (in), SClkP_Chip (out), SClkP_FPGA (in), SEnable_Chip (out), SEnable_FPGA (in), SIn_Chip (out), SIn_FPGA (in), SOut_Chip (in), SOut_FPGA (out), SReset_Chip (out), SReset_FPGA (in), SUpdate_Chip (out), SUpdate_FPGA (in), VDD_Chip

### Nets
GND: C58#2.2 C59#2.1 C73.2 C74.1 C81.2 C82.2 C83.2 C84.2 C85.2 C86.1 C87.1 C88.1 C89.1 C90.1 U24.3(GND) U25.3(GND) U26.3(GND) U27.3(GND) U28.3(GND) U29.3(GND) U30.3(GND)
IOVDD: C58#2.1 C73.1 C81.1 C82.1 C83.1 C84.1 C85.1 U24.1(VCCA) U25.1(VCCA) U26.1(VCCA) U27.1(VCCA) U28.1(VCCA) U29.1(VCCA) U30.5(VCCB) ; port IOVDD
VOUT: C59#2.2 C74.2 C86.2 C87.2 C88.2 C89.2 C90.2 U24.5(VCCB) U25.5(VCCB) U26.5(VCCB) U27.5(VCCB) U28.5(VCCB) U29.5(VCCB) U30.1(VCCA) ; port VDD_Chip
SClkN_Chip: U24.4(B) ; port SClkN_Chip
SClkN_FPGA: U24.2(A) ; port SClkN_FPGA
SClkP_Chip: U25.4(B) ; port SClkP_Chip
SClkP_FPGA: U25.2(A) ; port SClkP_FPGA
SEnable_Chip: U29.4(B) ; port SEnable_Chip
SEnable_FPGA: U29.2(A) ; port SEnable_FPGA
SIn_Chip: U26.4(B) ; port SIn_Chip
SIn_FPGA: U26.2(A) ; port SIn_FPGA
SOut_Chip: U30.2(A) ; port SOut_Chip
SOut_FPGA: R50#2.2 ; port SOut_FPGA
SReset_Chip: U27.4(B) ; port SReset_Chip
SReset_FPGA: U27.2(A) ; port SReset_FPGA
SUpdate_Chip: U28.4(B) ; port SUpdate_Chip
SUpdate_FPGA: U28.2(A) ; port SUpdate_FPGA
NetR50#2_1: R50#2.1 U30.4(B)

### Notes on the sheet
- todo: decaps (do we really need 1 per?)
- Unidirectional A->B

### Library data of the parts
C58#2 C59#2 C73 C74 C81-C90 = CMP-2000-05439-1: as C35 on sheet TIA_signal_path_ADC; Case Size/Dimension: 0402; Tolerance (%): ±10%; Manufacturer URL: http://www.samsungsem.com/global/index.jsp; Dielectric: X7R; Datasheet URL: https://datasheet.ciiva.com/29198/458718-da-01-en-vs-kondensator-0402-29198423.pdf; Datasheet Version: Nov-10
R50#2 = CMP-2000-03820-1: as R47 on sheet DACs
U24-U30 = CMP-0859-00330-4: IC TRNSLTR UNIDIRECTIONAL SC70-5; Manufacturer: Texas Instruments; V B Max: 3.6V; Propagation Delay: 4.28ns; Description: Voltage Level Translator Unidirectional 1 Circuit 1 Channel  SC-70-5; Min Supply Voltage: 0.9V; Nominal Supply Current: 5.2uA; Frequency: 190MHz; Number Of Inputs: 1; Max Junction Temp: +150°C; Standoff Height: 0mm; Logic Function Desc: Non-Inverting; Ambient Temperature Range High: +85°C; Octopart: https://octopart.com/sn74aup1t34dckr-texas+instruments-22791115; Max Supply Voltage: 3.6V; Mouser Description: 1-Bit Unidirectional Voltage-Level Translator 5-SC70 -40 to 85; ComponentLink2URL: http://www.ti.com/lit/ds/symlink/sn74aup1t34.pdf; Category: IC; Device Class L1: Integrated Circuits (ICs); Manufacturer Part Number: SN74AUP1T34DCKR; Temperature: -40°C to +85°C; V A Min: 0.9V; Ambient Temperature Range Low: -40°C; V A Max: 3.6V; Package: DCK0005A; Device Class L3: Voltage Level Shifters; Number Of Outputs: 1; Digikey Description: IC TRNSLTR UNIDIRECTIONAL SC70-5; Device Class L2: Logic ICs; Temperature Range Low: -40°C; Number Of Circuits: 1; Lead Free: Yes; ComponentLink2Description: Datasheet; RoHS: TRUE; Height: 1.1mm; Automotive: No; Temperature Range High: +85°C; V B Min: 0.9V

## Sheet monitoring_ADC.SchDoc
size A; SheetNumber: 9; SheetTotal: 9
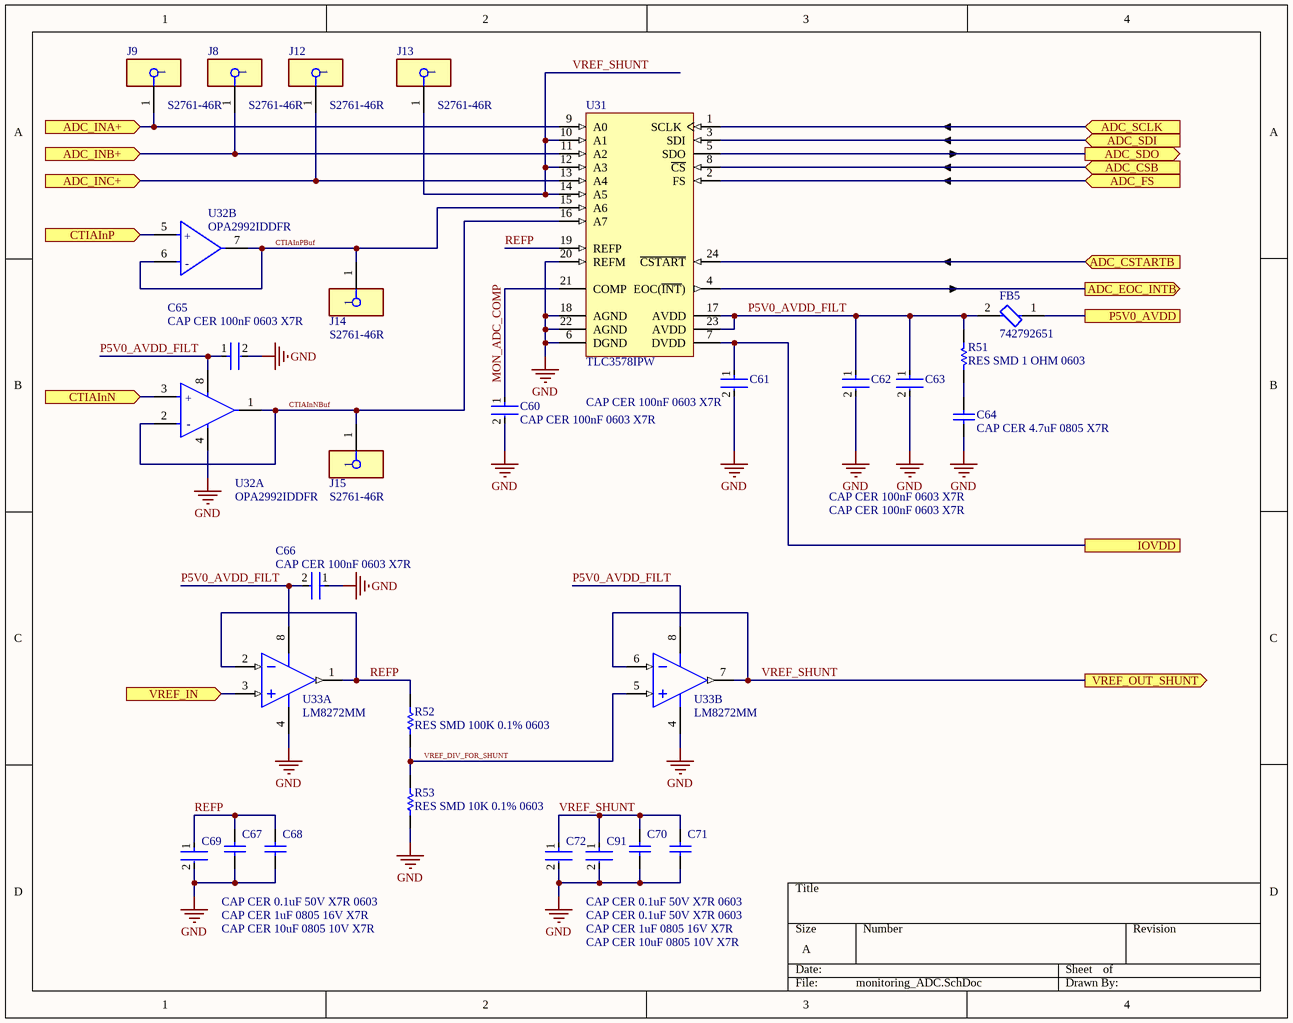
[diagram p8: monitoring_ADC.SchDoc]

### Parts
(Parts that share a designator on the sheet are numbered #1, #2 ... from top to bottom, then left to right.)
C60#2  CAP CER 100nF 0603 X7R  [FP-CC0603-DA-MFG]
C61#2  CAP CER 100nF 0603 X7R  [FP-CC0603-DA-MFG]
C62#2  CAP CER 100nF 0603 X7R  [FP-CC0603-DA-MFG]
C63#2  CAP CER 100nF 0603 X7R  [FP-CC0603-DA-MFG]
C64  CAP CER 4.7uF 0805 X7R  [CAPC2013X140X50NL20T25]
C65  CAP CER 100nF 0603 X7R  [FP-CC0603-DA-MFG]
C66  CAP CER 100nF 0603 X7R  [FP-CC0603-DA-MFG]
C67  CAP CER 1uF 0805 16V X7R  [CAPC2013X140X50NL20T25]
C68  CAP CER 10uF 0805 10V X7R  [CAPC2013X140X50NL20T25]
C69  CAP CER 0.1uF 50V X7R 0603  [FP-CC0603-DA-MFG]
C70  CAP CER 1uF 0805 16V X7R  [CAPC2013X140X50NL20T25]
C71  CAP CER 10uF 0805 10V X7R  [CAPC2013X140X50NL20T25]
C72  CAP CER 0.1uF 50V X7R 0603  [FP-CC0603-DA-MFG]
C91  CAP CER 0.1uF 50V X7R 0603  [FP-CC0603-DA-MFG]
FB5  742792651  [FP-742792651-MFG]
J8#2  S2761-46R  [FP-S2761-46R-MFG]
J9#2  S2761-46R  [FP-S2761-46R-MFG]
J12#2  S2761-46R  [FP-S2761-46R-MFG]
J13#2  S2761-46R  [FP-S2761-46R-MFG]
J14#2  S2761-46R  [FP-S2761-46R-MFG]
J15#2  S2761-46R  [FP-S2761-46R-MFG]
R51#2  RES SMD 1 OHM 0603  [RESC1609X50X30LL10T20]
R52#2  RES SMD 100K 0.1% 0603  [RESC1609X50X30LL10T20]
R53#2  RES SMD 10K 0.1% 0603  [RESC1609X50X30LL10T20]
U31  TLC3578IPW  [TI-PW24_N]
U32  OPA2992IDDFR  [FP-DDF0008A-MFG]  (parts A,B of 2)
U33  LM8272MM  [DGK0008A_L]  (parts A,B of 2)

### Ports
ADC_CSB (in), ADC_CSTARTB (in), ADC_EOC_INTB (out), ADC_FS (in), ADC_INA+ (in), ADC_INB+ (in), ADC_INC+ (in), ADC_SCLK (in), ADC_SDI (in), ADC_SDO (out), CTIAInN (in), CTIAInP (in), IOVDD, P5V0_AVDD, VREF_IN (in), VREF_OUT_SHUNT (out)

### Nets
GND: C60#2.2 C61#2.2 C62#2.2 C63#2.2 C64.2 C65.2 C66.1 C67.2 C68.2 C69.2 C70.2 C71.2 C72.2 C91.2 R53#2.1 U31.6(DGND) U31.18(AGND) U31.20(REFM) U31.22(AGND) U32.4(V-) U33.4(V-)
IOVDD: C61#2.1 U31.7(DVDD) ; port IOVDD
P5V0: FB5.1 ; port P5V0_AVDD
CTIAInNBuf: J15#2.1 U31.16(A7) U32.1(OUT1) U32.2(IN1-)
CTIAInPBuf: J14#2.1 U31.15(A6) U32.6(IN2-) U32.7(OUT2)
CTIAOutN: U32.3(IN1+) ; port CTIAInN
CTIAOutP: U32.5(IN2+) ; port CTIAInP
DAC_VREF_4V096: U33.3(INA+) ; port VREF_IN
MON_ADC_COMP: C60#2.1 U31.21(COMP)
MON_ADC_CSB: U31.8(~{CS}) ; port ADC_CSB
MON_ADC_CSTARTB: U31.24(~{CSTART}) ; port ADC_CSTARTB
MON_ADC_EOC_INTB: U31.4(EOC(~{INT})) ; port ADC_EOC_INTB
MON_ADC_FS: U31.2(FS) ; port ADC_FS
MON_ADC_SCLK: U31.1(SCLK) ; port ADC_SCLK
MON_ADC_SDI: U31.3(SDI) ; port ADC_SDI
MON_ADC_SDO: U31.5(SDO) ; port ADC_SDO
P5V0_AVDD_FILT: C62#2.1 C63#2.1 C65.1 C66.2 FB5.2 R51#2.2 U31.17(AVDD) U31.23(AVDD) U32.8(V+) U33.8(V+)
REFP: C67.1 C68.1 C69.1 R52#2.2 U31.19(REFP) U33.1(OUTA) U33.2(INA-)
VREF_DIV_FOR_SHUNT: R52#2.1 R53#2.2 U33.5(INB+)
VREF_SHUNT: C70.1 C71.1 C72.1 C91.1 J13#2.1 U31.10(A1) U31.12(A3) U31.14(A5) U33.6(INB-) U33.7(OUTB) ; port VREF_OUT_SHUNT
VSHUNT_AVDD: J12#2.1 U31.13(A4) ; port ADC_INC+
VSHUNT_HVDD: J8#2.1 U31.11(A2) ; port ADC_INB+
VSHUNT_VDD: J9#2.1 U31.9(A0) ; port ADC_INA+
NetC64_1: C64.1 R51#2.1

### Notes on the sheet
- (in symbol CMP-04895-000462-1, part A) +; -
- (in symbol CMP-04895-000462-1, part B) +; -

### Library data of the parts
C60#2 C61#2 C62#2 C63#2 C65 C66 = CMP-03422-000030-1: as C55 on sheet DACs; Voltage Rating: 16 V; Package: CC0603-DA; ComponentLink2Description: Datasheet; Octopart: https://octopart.com/cc0603krx7r7bb104-yageo-192941; Temperature Range High: +125°C; Digikey Description: CAP CER 0.1UF 16V X7R 0603; Value: 100 nF; Voltage: 16 V; Device Class L2: Capacitors; Height: 0.9mm; Temperature: -55°C to +125°C; Device Class L1: Passive Components; Device Class L3: Ceramic Capacitors; ComponentLink2URL: http://www.yageo.com/documents/recent/UPY-GPHC_X7R_6.3V-to-50V_18.pdf; Footprint Url: http://www.yageo.com/exep/pages/download/literatures/UPY-C_GEN_24.pdf; RoHS: TRUE; Temperature Range Low: -55°C; Temperature Characteristic: X7R; Lead Free: Yes; Capacitance: 100 nF; Category: Cap; Mouser Description: Multilayer Ceramic Capacitor, CC Series, 0.1 - F, - 10%, X7R, 16 V, 0603 [1608 Metric]; Automotive: No
C64 C67 C68 C70 C71 = CMP-2007-04677-1: as C49 on sheet DACs
C69 C72 C91 = CMP-03422-000030-1: as C51 on sheet DACs; Package: CC0603-DA; ComponentLink2Description: Datasheet; Octopart: https://octopart.com/cc0603krx7r7bb104-yageo-192941; Temperature Range High: +125°C; Digikey Description: CAP CER 0.1UF 16V X7R 0603; Voltage: 16 V; Device Class L2: Capacitors; Height: 0.9mm; Temperature: -55°C to +125°C; Device Class L1: Passive Components; Device Class L3: Ceramic Capacitors; ComponentLink2URL: http://www.yageo.com/documents/recent/UPY-GPHC_X7R_6.3V-to-50V_18.pdf; Footprint Url: http://www.yageo.com/exep/pages/download/literatures/UPY-C_GEN_24.pdf; RoHS: TRUE; Temperature Range Low: -55°C; Temperature Characteristic: X7R; Lead Free: Yes; Capacitance: 100 nF; Category: Cap; Mouser Description: Multilayer Ceramic Capacitor, CC Series, 0.1 - F, - 10%, X7R, 16 V, 0603 [1608 Metric]; Automotive: No
FB5 = CMP-0220-00181-2: as FB2 on sheet DACs; Length: 1.6mm; Termination: SMD/SMT; Case Code (Metric): 1608; Case/Package: SMD/SMT; Min Operating Temperature: -55°C; Resistance: 200mR; Height: 0.8mm; Width: 0.8mm; Max Operating Temperature: 125°C; Package Quantity: 1; Mount: Surface Mount; Max DC Current: 1A; Max Current Rating: 1A; Weight: 0.000141oz; Packaging: Tape and Reel; Lead Free: Lead Free; Case Code (Imperial): 0603; Series: WE-CBF; Core Material: Ferrite; Material: Ferrite; RoHS Compliant: Yes; Depth: 0.8mm
J8#2 J9#2 J12#2 J13#2 J14#2 J15#2 = CMP-15817-000011-1: as J10 on sheet TIA_signal_path_ADC; Material: Copper Alloy; Mount: Surface Mount; Color: Natural; Packaging: Tape and Reel; RoHS Compliant: Yes
R51#2 = CMP-2000-03820-1: as R47 on sheet DACs
R52#2 R53#2 = CMP-2000-03820-1: as R40#2 on sheet TIA_signal_path_ADC
U31 = CMP-0003-02027-1: Serial Out, Low Power with Built-In Conversion Clock and 8 x FIFO, 8 Channel, -40 to 85 degC, 24-pin SOP (PW24), Green (RoHS & no Sb/Br); Manufacturer: Texas Instruments; Interface: Serial SPI; SubFamily: Precision ADC (<=10MSPS); SNR(dB): 80; INL(Max)(+/-LSB): 1.5; Analog Voltage AV/DD(Min)(V): 4.75; Digital Supply(Max)(V): 5.5; SFDR(dB): 84; # Input Channels: 8; Resolution(Bits): 14; SINAD(dB): 79; Sample Rate (max)(SPS): 200k; ENOB(Bits): 12.8; Architecture: SAR; Digital Supply(Min)(V): 2.7; ComponentLink2Description: Datasheet; ComponentLink2URL: http://www.ti.com/general/docs/lit/getliterature.tsp?genericPartNumber=TLC3578&fileType=pdf; ComponentLink1URL: http://www.ti.com/; Code_JEDEC: MO-153; PackageDescription: 24-Pin Plastic Small Outline, Body 7.8 x 4.4 mm, Pitch 0.65 mm; PartNumber: TLC3578IPW; PackageVersion: 4040064-6/G, 02/2011; PackageReference: PW24; DatasheetVersion: SLAS262C; Eco-Plan: Green (RoHS & no Sb/Br); Analog Voltage AV/DD(Max)(V): 5.5; ComponentLink3URL: http://www.ti.com/litv/pdf/mpds363; Mounting Technology: Surface Mount; ComponentLink1Description: Manufacturer URL; ComponentLink3Description: Package Specification
U32 = CMP-04895-000462-1: IC OPAMP GP 2 CIRCUIT TSOT23-8
U33 = CMP-0055-01394-3: as U13 on sheet TIA_signal_path_ADC; RoHS: N; ComponentLink1Description: Datasheet URL; PinCount: 8; Code_JEDEC: MO-187-AA; Package Reference: DGK0008A; ComponentLink1URL: http://www.ti.com/general/docs/lit/getliterature.tsp?genericPartNumber=LM8272&fileType=pdf; PackageDescription: MINI SOIC, .118 x .118 x .034in, 8 Lead, .0256in Pitch

## Nets that join several sheets
GND: isg_cena_host_board_rev1_top (126 pins), VV (14 pins), VH (14 pins), VA (14 pins), NA (8 pins), PA (8 pins), PB (C8_PB.2 R22_PB.2 R26_PB.2 U3_PB.4), NB (C8_NB.2 R22_NB.2 R26_NB.2 U3_NB.4), charge_pump (16 pins), DACs (21 pins), TIA_signal_path_ADC (48 pins), scan_chain_level_shifters (21 pins), monitoring_ADC (21 pins)
IOVDD: charge_pump (5 pins), DACs (C53.1 C62#1.1 U20.12 U23.12), TIA_signal_path_ADC (11 pins), scan_chain_level_shifters (14 pins), monitoring_ADC (C61#2.1 U31.7)
P5V0: isg_cena_host_board_rev1_top (P1.2 TP1.1), VV (7 pins), VH (7 pins), VA (7 pins), NA (8 pins), PA (8 pins), PB (C8_PB.1 U3_PB.8), NB (C8_NB.1 U3_NB.8), charge_pump (6 pins), DACs (FB2.1 FB3.1 FB4.1), TIA_signal_path_ADC (FB1.1), monitoring_ADC (FB5.1)
VOUT: isg_cena_host_board_rev1_top (X2.5 X2.6), VA (8 pins), PB (U3_PB.3 U3_PB.5), NB (U3_NB.5)
VOUT: isg_cena_host_board_rev1_top (X1.3 X1.4 X1.5 X1.6), VV (8 pins), NB (U3_NB.3), scan_chain_level_shifters (14 pins)
VOUT: isg_cena_host_board_rev1_top (X1.9 X1.10 X1.11 X1.12), VH (8 pins)
VPD_Anode: isg_cena_host_board_rev1_top (X2.1 X2.2), charge_pump (7 pins)
ADC_CNV: isg_cena_host_board_rev1_top (J6.4), TIA_signal_path_ADC (U11#2.9 U14.3)
ADC_SCK: isg_cena_host_board_rev1_top (J6.2), TIA_signal_path_ADC (U11#2.13 U17.3)
ADC_SDO: isg_cena_host_board_rev1_top (J8#1.8), TIA_signal_path_ADC (U11#2.14 U18.3)
CP_EN_M: isg_cena_host_board_rev1_top (J7.6), charge_pump (R34.1 U11#1.8)
CTIAOutN: isg_cena_host_board_rev1_top (X2.32), TIA_signal_path_ADC (J11.1 U19.1), monitoring_ADC (U32.3)
CTIAOutP: isg_cena_host_board_rev1_top (X2.34), TIA_signal_path_ADC (J10.1 U19.8), monitoring_ADC (U32.5)
DAC1_SYNCB: isg_cena_host_board_rev1_top (J5.16), DACs (U20.9)
DAC1_VOUTA: VV (R10_VV_VV.2), DACs (TP15.1 U20.1)
DAC1_VOUTB: VH (R10_VV_VH.2), DACs (TP16.1 U20.2)
DAC1_VOUTC: VA (R10_VV_VA.2), DACs (TP17.1 U20.7)
DAC1_VOUTD: charge_pump (R37.2), DACs (TP18.1 U20.8)
DAC2_SYNCB: isg_cena_host_board_rev1_top (J5.14), DACs (U23.9)
DAC2_VOUTA: NA (U5_NA.3), DACs (TP20.1 U23.1)
DAC2_VOUTB: NA (U10_NA.3), DACs (TP21.1 U23.2)
DAC2_VOUTC: PA (U5_PA.3), DACs (TP22.1 U23.7)
DAC2_VOUTD: PA (U10_PA.3), DACs (TP23#2.1 U23.8)
DAC_DIN: isg_cena_host_board_rev1_top (J5.10), DACs (U20.11 U23.11)
DAC_ENB: isg_cena_host_board_rev1_top (J5.4), DACs (U20.15 U23.15)
DAC_LDAC: isg_cena_host_board_rev1_top (J5.2), DACs (U20.16 U23.16)
DAC_RSTB: isg_cena_host_board_rev1_top (J5.8), DACs (U20.13 U23.13)
DAC_RSTSEL: isg_cena_host_board_rev1_top (J5.6), DACs (U20.14 U23.14)
DAC_SCLK: isg_cena_host_board_rev1_top (J5.12), DACs (U20.10 U23.10)
DAC_VREF_4V096: DACs (6 pins), monitoring_ADC (U33.3)
EN: isg_cena_host_board_rev1_top (J1.14), VV (R2_VV_VV.1 R6_VV_VV.2 U3_VV_VV.5)
EN: isg_cena_host_board_rev1_top (J7.2), VH (R2_VV_VH.1 R6_VV_VH.2 U3_VV_VH.5)
EN: isg_cena_host_board_rev1_top (J7.4), VA (R2_VV_VA.1 R6_VV_VA.2 U3_VV_VA.5)
EN_IOVDD: isg_cena_host_board_rev1_top (J1.16), charge_pump (R35.1 U11#1.12)
IOUT_1mA: isg_cena_host_board_rev1_top (Q2.1), PA (R17_PA.1 U9_PA.3)
IOUT_1mA: NA (R17_NA.1 U9_NA.3), NB (R54_NB.2)
IOUT_100uA: isg_cena_host_board_rev1_top (Q1.1), PA (R18_PA.1 U9_PA.5)
IOUT_100uA: NA (R18_NA.1 U9_NA.5), NB (R56_NB.2)
IRefCML2CMOS: isg_cena_host_board_rev1_top (X1.45), NB (R19_NB.2 TP20_NB.1)
IRefCTIA: isg_cena_host_board_rev1_top (X2.24), PB (R23_PB.2 TP22_PB.1)
IRefCTIAPNPMirOut: isg_cena_host_board_rev1_top (Q1.2), PB (R56_PB.2)
IRefLocalBuf: isg_cena_host_board_rev1_top (X2.26), NB (R23_NB.2 TP22_NB.1)
IRefPadBuf: isg_cena_host_board_rev1_top (X2.28), PB (R19_PB.2 TP20_PB.1)
IRefPadBufPNPMirOut: isg_cena_host_board_rev1_top (Q2.2), PB (R54_PB.2)
MON_ADC_CSB: isg_cena_host_board_rev1_top (J7.10), monitoring_ADC (U31.8)
MON_ADC_CSTARTB: isg_cena_host_board_rev1_top (J7.8), monitoring_ADC (U31.24)
MON_ADC_EOC_INTB: isg_cena_host_board_rev1_top (J8#1.2), monitoring_ADC (U31.4)
MON_ADC_FS: isg_cena_host_board_rev1_top (J7.16), monitoring_ADC (U31.2)
MON_ADC_SCLK: isg_cena_host_board_rev1_top (J7.14), monitoring_ADC (U31.1)
MON_ADC_SDI: isg_cena_host_board_rev1_top (J7.12), monitoring_ADC (U31.3)
MON_ADC_SDO: isg_cena_host_board_rev1_top (J8#1.4), monitoring_ADC (U31.5)
SClkN_Chip: isg_cena_host_board_rev1_top (X1.19), scan_chain_level_shifters (U24.4)
SClkN_FPGA: isg_cena_host_board_rev1_top (J1.2), scan_chain_level_shifters (U24.2)
SClkP_Chip: isg_cena_host_board_rev1_top (X1.31), scan_chain_level_shifters (U25.4)
SClkP_FPGA: isg_cena_host_board_rev1_top (J1.4), scan_chain_level_shifters (U25.2)
SEnable_Chip: isg_cena_host_board_rev1_top (X1.23), scan_chain_level_shifters (U29.4)
SEnable_FPGA: isg_cena_host_board_rev1_top (J1.12), scan_chain_level_shifters (U29.2)
SIn_Chip: isg_cena_host_board_rev1_top (X1.15), scan_chain_level_shifters (U26.4)
SIn_FPGA: isg_cena_host_board_rev1_top (J1.6), scan_chain_level_shifters (U26.2)
SOut_Chip: isg_cena_host_board_rev1_top (X1.49), scan_chain_level_shifters (U30.2)
SOut_FPGA: isg_cena_host_board_rev1_top (J8#1.16), scan_chain_level_shifters (R50#2.2)
SP_ADC_BUSY: isg_cena_host_board_rev1_top (J8#1.6), TIA_signal_path_ADC (U11#2.11)
SReset_Chip: isg_cena_host_board_rev1_top (X1.27), scan_chain_level_shifters (U27.4)
SReset_FPGA: isg_cena_host_board_rev1_top (J1.8), scan_chain_level_shifters (U27.2)
SUpdate_Chip: isg_cena_host_board_rev1_top (X1.35), scan_chain_level_shifters (U28.4)
SUpdate_FPGA: isg_cena_host_board_rev1_top (J1.10), scan_chain_level_shifters (U28.2)
VREF_SHUNT: VV (U1_VV_VV.1), VH (U1_VV_VH.1), VA (U1_VV_VA.1), monitoring_ADC (10 pins)
VSHUNT_AVDD: VA (U1_VV_VA.6), monitoring_ADC (J12#2.1 U31.13)
VSHUNT_HVDD: VH (U1_VV_VH.6), monitoring_ADC (J8#2.1 U31.11)
VSHUNT_VDD: VV (U1_VV_VV.6), monitoring_ADC (J9#2.1 U31.9)